# Altium schematic sheet DB4100_MCU.SchDoc
size A3
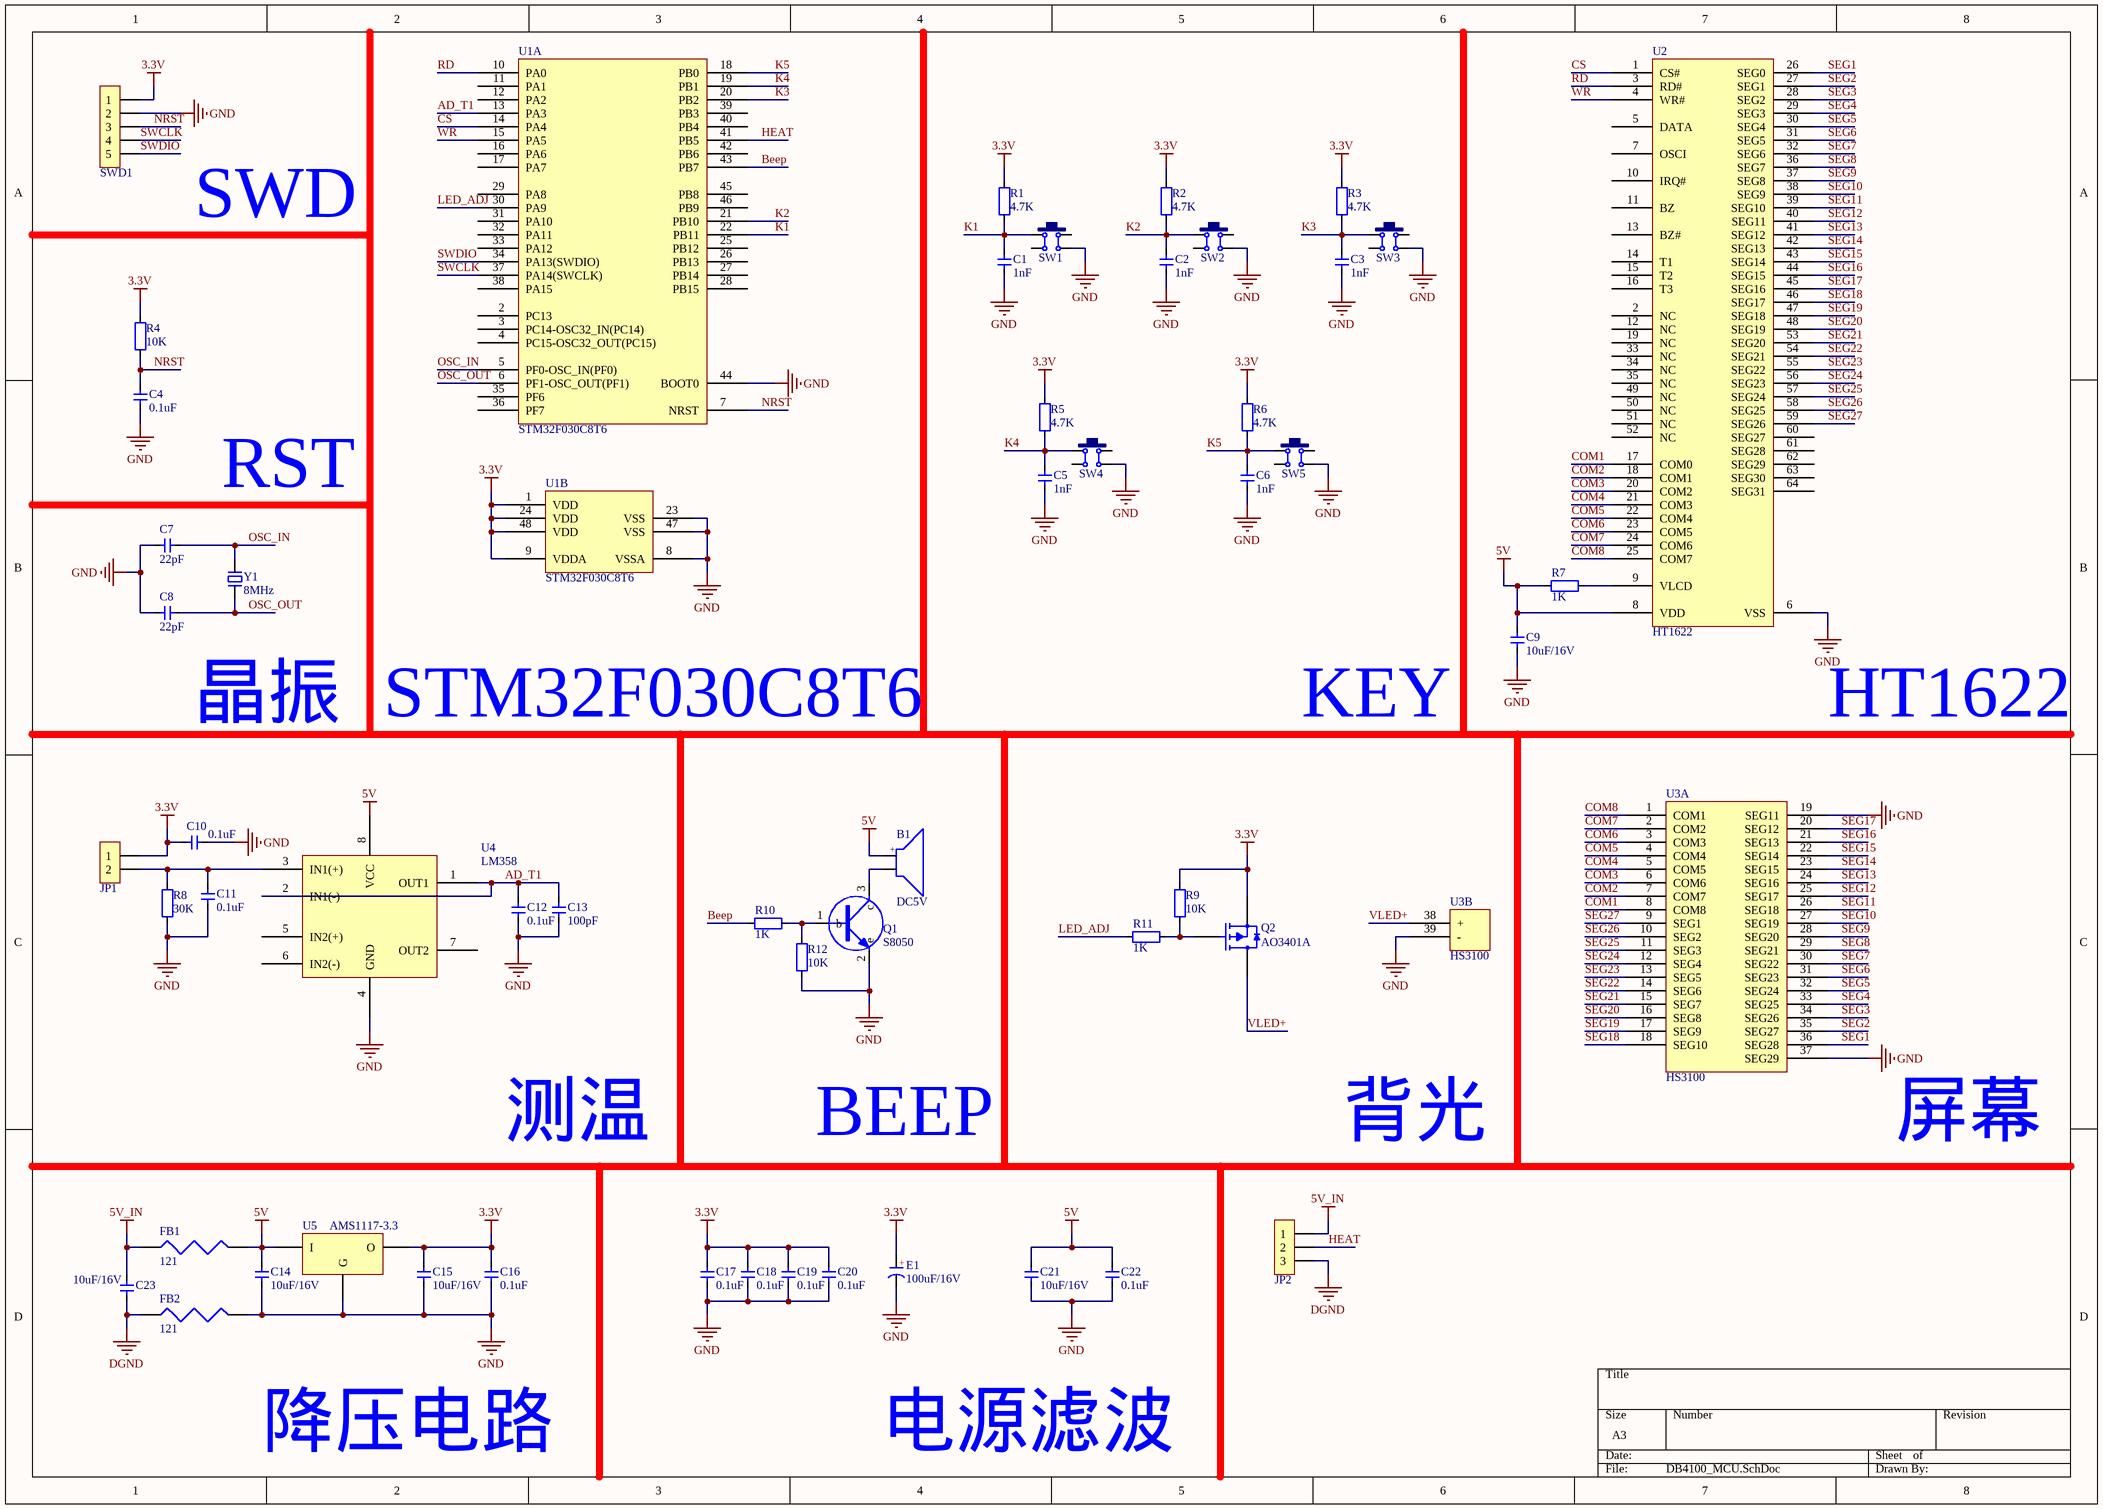
[diagram p0: DB4100_MCU.SchDoc]

## Parts
B1  DC5V  [BEEP 7.6X12X7.5]
C1  1nF  [C 0603]
C2  1nF  [C 0603]
C3  1nF  [C 0603]
C4  0.1uF  [C 0603]
C5  1nF  [C 0603]
C6  1nF  [C 0603]
C7  22pF  [C 0603]
C8  22pF  [C 0603]
C9  10uF/16V  [C 0805]
C10  0.1uF  [C 0603]
C11  0.1uF  [C 0603]
C12  0.1uF  [C 0603]
C13  100pF  [C 0603]
C14  10uF/16V  [C 0805]
C15  10uF/16V  [C 0805]
C16  0.1uF  [C 0603]
C17  0.1uF  [C 0603]
C18  0.1uF  [C 0603]
C19  0.1uF  [C 0603]
C20  0.1uF  [C 0603]
C21  10uF/16V  [C 0805]
C22  0.1uF  [C 0603]
C23  10uF/16V  [C 0805]
E1  100uF/16V  [CM D(6.3*5.4)]
FB1  121  [L 0805]
FB2  121  [L 0805]
JP1  HDR-1X2  [XH2.54-2P]  (value not drawn)
JP2  HDR-1X3  [XH2.54-3P]  (value not drawn)
Q1  S8050  [SOT23-3L]
Q2  AO3401A  [SOT23-3]
R1  4.7K  [R 0603]
R2  4.7K  [R 0603]
R3  4.7K  [R 0603]
R4  10K  [R 0603]
R5  4.7K  [R 0603]
R6  4.7K  [R 0603]
R7  1K  [R 0603]
R8  30K  [R 0603]
R9  10K  [R 0603]
R10  1K  [R 0603]
R11  1K  [R 0603]
R12  10K  [R 0603]
SW1  6x6x5  [TSW SMD-6*6*7]  (value not drawn)
SW2  6x6x5  [TSW SMD-6*6*7]  (value not drawn)
SW3  6x6x5  [TSW SMD-6*6*7]  (value not drawn)
SW4  6x6x5  [TSW SMD-6*6*7]  (value not drawn)
SW5  6x6x5  [TSW SMD-6*6*7]  (value not drawn)
SWD1  HDR-1X5  [XH2.54-5P]  (value not drawn)
U1  STM32F030C8T6  [STM32F030C8T6]  (parts A,B of 2)
U2  HT1622  [HT1622]
U3  HS3100  [HS3100]  (parts A,B of 2)
U4  LM358  [LM358]
U5  AMS1117-3.3  [AMS1117-3.3]
Y1  8MHz  [XTAL-49S SMD]

## Nets
3.3V: C10.1 C15.2 C16.2 C17.2 C18.2 C19.2 C20.2 E1.1(A) JP1.1 Q2.2(S) R1.2 R2.2 R3.2 R4.2 R5.2 R6.2 R9.2 SWD1.1 U1.1(VDD) U1.9(VDDA) U1.24(VDD) U1.48(VDD) U5.2(O)
5V: B1.1 C9.2 C14.2 C21.2 C22.2 FB1.2 R7.1 U2.8(VDD) U4.8(VCC) U5.3(I)
5V_IN: C23.2 FB1.1 JP2.1
DGND: C23.1 FB2.1 JP2.3
GND: C1.1 C2.1 C3.1 C4.1 C5.1 C6.1 C7.1 C8.1 C9.1 C10.2 C11.1 C12.1 C13.1 C14.1 C15.1 C16.1 C17.1 C18.1 C19.1 C20.1 C21.1 C22.1 E1.2(K) FB2.2 Q1.2(e) R8.1 R12.1 SW1.3 SW2.3 SW3.3 SW4.3 SW5.3 SWD1.2 U1.8(VSSA) U1.23(VSS) U1.44(BOOT0) U1.47(VSS) U2.6(VSS) U3.19(SEG11) U3.37(SEG29) U3.39(-) U4.4(GND) U5.1(G)
AD_T1: C12.2 C13.2 U1.13(PA3) U4.1(OUT1) U4.2(IN1(-))
Beep: R10.1 U1.43(PB7)
COM1: U2.17(COM0) U3.8(COM8)
COM2: U2.18(COM1) U3.7(COM7)
COM3: U2.20(COM2) U3.6(COM6)
COM4: U2.21(COM3) U3.5(COM5)
COM5: U2.22(COM4) U3.4(COM4)
COM6: U2.23(COM5) U3.3(COM3)
COM7: U2.24(COM6) U3.2(COM2)
COM8: U2.25(COM7) U3.1(COM1)
CS: U1.14(PA4) U2.1(CS#)
HEAT: JP2.2 U1.41(PB5)
K1: C1.2 R1.1 SW1.1 U1.22(PB11)
K2: C2.2 R2.1 SW2.1 U1.21(PB10)
K3: C3.2 R3.1 SW3.1 U1.20(PB2)
K4: C5.2 R5.1 SW4.1 U1.19(PB1)
K5: C6.2 R6.1 SW5.1 U1.18(PB0)
LED_ADJ: R11.1 U1.30(PA9)
NRST: C4.2 R4.1 SWD1.3 U1.7(NRST)
OSC_IN: C7.2 U1.5(PF0-OSC_IN(PF0)) Y1.2
OSC_OUT: C8.2 U1.6(PF1-OSC_OUT(PF1)) Y1.1
RD: U1.10(PA0) U2.3(RD#)
SEG1: U2.26(SEG0) U3.36(SEG28)
SEG2: U2.27(SEG1) U3.35(SEG27)
SEG3: U2.28(SEG2) U3.34(SEG26)
SEG4: U2.29(SEG3) U3.33(SEG25)
SEG5: U2.30(SEG4) U3.32(SEG24)
SEG6: U2.31(SEG5) U3.31(SEG23)
SEG7: U2.32(SEG6) U3.30(SEG22)
SEG8: U2.36(SEG7) U3.29(SEG21)
SEG9: U2.37(SEG8) U3.28(SEG20)
SEG10: U2.38(SEG9) U3.27(SEG19)
SEG11: U2.39(SEG10) U3.26(SEG18)
SEG12: U2.40(SEG11) U3.25(SEG17)
SEG13: U2.41(SEG12) U3.24(SEG16)
SEG14: U2.42(SEG13) U3.23(SEG15)
SEG15: U2.43(SEG14) U3.22(SEG14)
SEG16: U2.44(SEG15) U3.21(SEG13)
SEG17: U2.45(SEG16) U3.20(SEG12)
SEG18: U2.46(SEG17) U3.18(SEG10)
SEG19: U2.47(SEG18) U3.17(SEG9)
SEG20: U2.48(SEG19) U3.16(SEG8)
SEG21: U2.53(SEG20) U3.15(SEG7)
SEG22: U2.54(SEG21) U3.14(SEG6)
SEG23: U2.55(SEG22) U3.13(SEG5)
SEG24: U2.56(SEG23) U3.12(SEG4)
SEG25: U2.57(SEG24) U3.11(SEG3)
SEG26: U2.58(SEG25) U3.10(SEG2)
SEG27: U2.59(SEG26) U3.9(SEG1)
SWCLK: SWD1.4 U1.37(PA14(SWCLK))
SWDIO: SWD1.5 U1.34(PA13(SWDIO))
VLED+: Q2.3(D) U3.38(+)
WR: U1.15(PA5) U2.4(WR#)
NetB1_2: B1.2 Q1.3(c)
NetC11_2: C11.2 JP1.2 R8.2 U4.3(IN1(+))
NetQ1_1: Q1.1(b) R10.2 R12.2
NetQ2_1: Q2.1(G) R9.1 R11.2
NetR7_2: R7.2 U2.9(VLCD)

Not connected (* = marked no-connect by the designer): SW1 2 4; SW2 2 4; SW3 2 4; SW4 2 4; SW5 2 4; U1 2(PC13) 3(PC14-OSC32_IN(PC14)) 4(PC15-OSC32_OUT(PC15)) 11(PA1) 12(PA2) 16(PA6) 17(PA7) 25(PB12) 26(PB13) 27(PB14) 28(PB15) 29(PA8) 31(PA10) 32(PA11) 33(PA12) 35(PF6) 36(PF7) 38(PA15) 39(PB3) 40(PB4) 42(PB6) 45(PB8) 46(PB9); U2 2(NC) 5(DATA) 7(OSCI) 10(IRQ#) 11(BZ) 12(NC) 13(BZ#) 14(T1) 15(T2) 16(T3) 19(NC) 33(NC) 34(NC) 35(NC) 49(NC) 50(NC) 51(NC) 52(NC) 60(SEG27) 61(SEG28) 62(SEG29) 63(SEG30) 64(SEG31); U4 5(IN2(+)) 6(IN2(-)) 7(OUT2)

## Notes on the sheet
- SWD
- RST
- 晶振
- STM32F030C8T6
- KEY
- HT1622
- 测温
- BEEP
- 背光
- 屏幕
- 降压电路
- 电源滤波
- (in symbol BEEP) +
- (in symbol C-CAP) +

## Library data of the parts
B1 = BEEP: 蜂鸣器; 版权归属: 源创客; BOM名称: 蜂鸣器; 学习资源: www.ooocke.com
C1-C23 = C: 无极性贴片电容; 版权归属: 源创客; BOM名称: 无极性贴片电容; 学习资源: www.ooocke.com
E1 = C-CAP: 直插电解电容; 版权归属: 源创客; BOM名称: 直插电解电容; 学习资源: www.ooocke.com
FB1 FB2 = FB: 磁珠
JP1 = Header 2: 2P接插件; 版权归属: 源创客; BOM名称: 2P接插件; 学习资源: www.ooocke.com
JP2 = Header 3: 3P接插件; 版权归属: 源创客; BOM名称: 3P接插件; 学习资源: www.ooocke.com
Q1 = NPN
Q2 = AO3401A: P-MOS
R1-R12 = R: 贴片电阻; 版权归属: 源创客; BOM名称: 贴片电阻; 学习资源: www.ooocke.com
SW1-SW5 = TSW SMD-6x6: 贴片6x6轻触开关; 版权归属: 源创客; BOM名称: 贴片6x6轻触开关; 学习资源: www.ooocke.com
SWD1 = Header 5: 5P接插件; 版权归属: 源创客; BOM名称: 5P接插件; 学习资源: www.ooocke.com
U1 = STM32F030C8T6: STM32F030采用ARM Cortex内核，运算速度高达48 MHz。STM32F030是STM32系列中价格最低的产品，具有全套外设，例如高速12位ADC、先进且灵活的定时器、日历RTC和通信接口（例如 I?C、USART和SPI）。
U2 = HT1622: LCD驱动，64引脚
U3 = HS3100: HS3100的屏幕
U4 = LM358: LM358是由两个独立的高增益运算放大器组成
U5 = AMS1117-3.3: 转3.3V电压
Y1 = XTAL-2: 2脚晶振; 版权归属: 源创客; BOM名称: 2脚晶振; 学习资源: www.ooocke.com